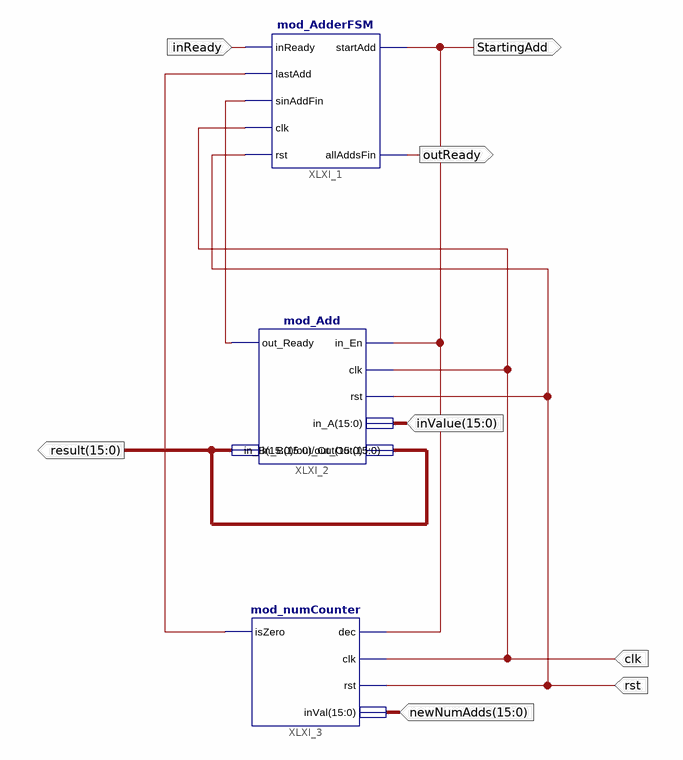
[diagram p0: schematic sheet 1]
// Xilinx ISE schematic mod_AddStage.sch (spartan3e) as structural Verilog: 3 symbols, 8 ports
module mod_AddStage (
  input  clk,
  input  rst,
  input  [15:0] newNumAdds,
  input  inReady,
  input  [15:0] inValue,
  output StartingAdd,
  output outReady,
  output [15:0] result
);

  wire XLXN_2, XLXN_11;

  mod_AdderFSM XLXI_1 (
    .inReady(inReady), .lastAdd(XLXN_2), .sinAddFin(XLXN_11), .clk(clk), .rst(rst), .startAdd(StartingAdd),
    .allAddsFin(outReady));
  mod_Add XLXI_2 (
    .in_En(StartingAdd), .clk(clk), .rst(rst), .in_A(inValue), .in_B(result), .out_Ready(XLXN_11),
    .out_Out(result));
  mod_numCounter XLXI_3 (.dec(StartingAdd), .clk(clk), .rst(rst), .inVal(newNumAdds), .isZero(XLXN_2));
endmodule
